# EAGLE schematic Autonomous-Car_Schematic-Extended (EAGLE 9.6.2)
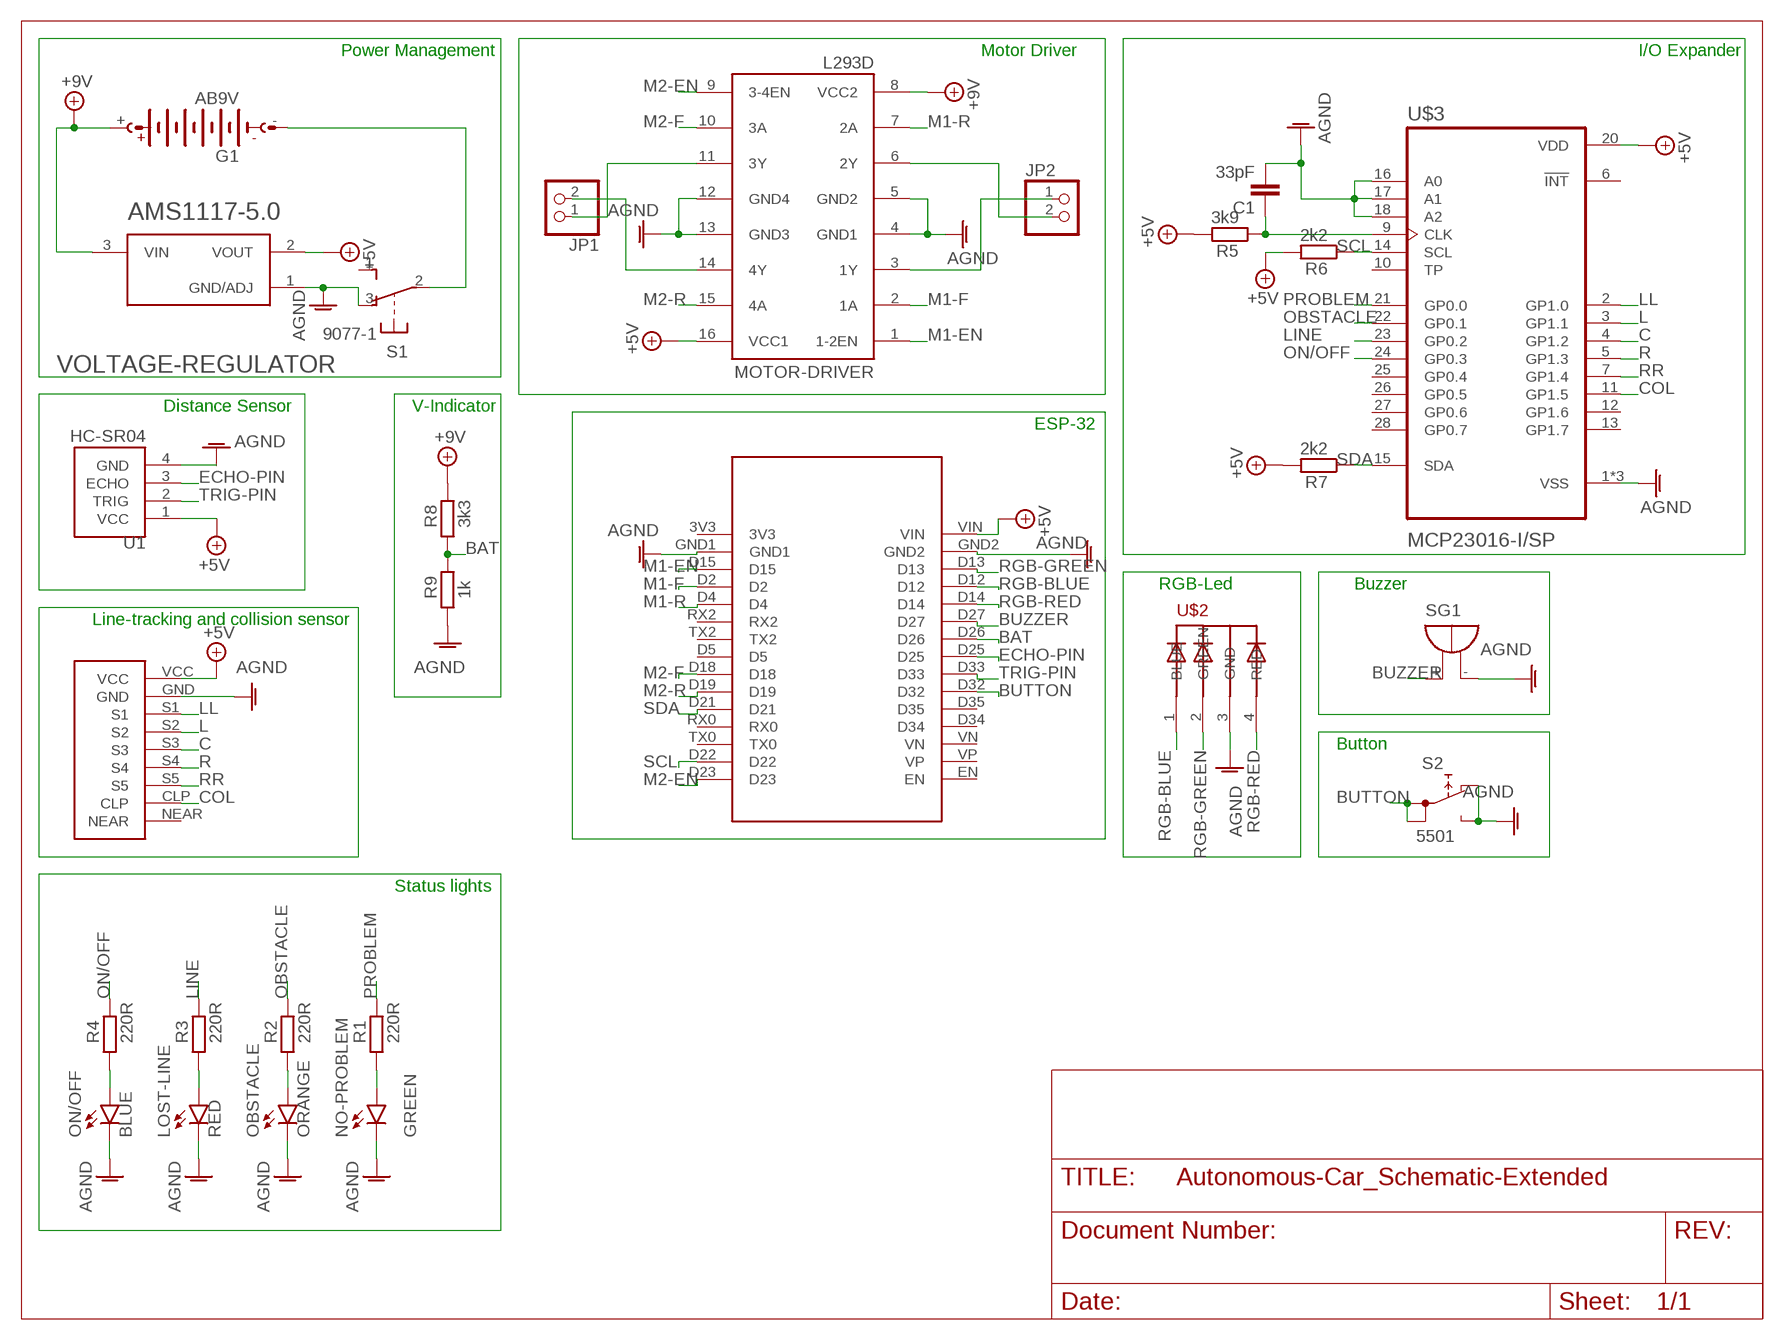
[diagram p0: schematic, sheet 1]

## Parts
C1  33pF  C-EU025-024X044  [C025-024X044]
G1  AB9V  [AB9V]
JP1  PINHD-1X2  [1X02]
JP2  PINHD-1X2  [1X02]
LINETRACKER  5XTCRT5000  [5XTCRT5000]
LOST-LINE  RED  LED5MM  [LED5MM]
MOTOR-DRIVER  L293D  [DIL16]
NO-PROBLEM  GREEN  LED5MM  [LED5MM]
OBSTACLE  ORANGE  LED5MM  [LED5MM]
ON/OFF  BLUE  LED5MM  [LED5MM]
R1  220R  R-EU_0204/5  [0204/5]
R2  220R  R-EU_0204/5  [0204/5]
R3  220R  R-EU_0204/5  [0204/5]
R4  220R  R-EU_0204/5  [0204/5]
R5  3k9  R-EU_0204/5  [0204/5]
R6  2k2  R-EU_0204/5  [0204/5]
R7  2k2  R-EU_0204/5  [0204/5]
R8  3k3  R-EU_0204/5  [0204/5]
R9  1k  R-EU_0204/5  [0204/5]
S1  9077-1  [9077-1]
S2  5501  [5501]
SG1  EB2209A  [EB2209A]
U1  HC-SR04  [XCVR_HC-SR04]
U$1  ESP32  [ESP32-FOOTPRINT]
U$2  5MMRGBLED  [LED5MMRGB]
U$3  MCP23016-I/SP  [DIP787W46P254L3467H508Q28]
VOLTAGE-REGULATOR  AMS1117-5.0  [SOT229P700X180-4N]

## Nets
+5V: LINETRACKER.VCC MOTOR-DRIVER.16(VCC1) R5.2 R6.2 R7.2 U1.1(VCC) U$1.VIN U$3.20(VDD) VOLTAGE-REGULATOR.2(VOUT)
+9V: G1.+ MOTOR-DRIVER.8(VCC2) R8.2 VOLTAGE-REGULATOR.3(VIN)
AGND: C1.2 LINETRACKER.GND LOST-LINE.K(C) MOTOR-DRIVER.4(GND1) MOTOR-DRIVER.5(GND2) MOTOR-DRIVER.12(GND4) MOTOR-DRIVER.13(GND3) NO-PROBLEM.K(C) OBSTACLE.K(C) ON/OFF.K(C) R9.1 S1.3(O) S2.NC S2.NO SG1.- U1.4(GND) U$1.GND1 U$1.GND2 U$2.3(GND) U$3.1(VSS) U$3.8(VSS) U$3.16(A0) U$3.17(A1) U$3.18(A2) U$3.19(VSS) VOLTAGE-REGULATOR.1(GND/ADJ)
BAT: R8.1 R9.2 U$1.D26
BUTTON: S2.1A S2.1B U$1.D32
BUZZER: SG1.+ U$1.D27
C: LINETRACKER.S3 U$3.4(GP1.2)
COL: LINETRACKER.CLP U$3.11(GP1.5)
ECHO-PIN: U1.3(ECHO) U$1.D25
L: LINETRACKER.S2 U$3.3(GP1.1)
LINE: R3.2 U$3.23(GP0.2)
LL: LINETRACKER.S1 U$3.2(GP1.0)
M1-EN: MOTOR-DRIVER.1(1-2EN) U$1.D15
M1-F: MOTOR-DRIVER.2(1A) U$1.D2
M1-R: MOTOR-DRIVER.7(2A) U$1.D4
M2-EN: MOTOR-DRIVER.9(3-4EN) U$1.D23
M2-F: MOTOR-DRIVER.10(3A) U$1.D18
M2-R: MOTOR-DRIVER.15(4A) U$1.D19
N$1: G1.- S1.2(P)
N$2: JP2.2 MOTOR-DRIVER.6(2Y)
N$3: JP2.1 MOTOR-DRIVER.3(1Y)
N$4: JP1.1 MOTOR-DRIVER.11(3Y)
N$5: JP1.2 MOTOR-DRIVER.14(4Y)
N$6: NO-PROBLEM.A R1.1
N$7: OBSTACLE.A R2.1
N$8: LOST-LINE.A R3.1
N$9: ON/OFF.A R4.1
N$10: C1.1 R5.1 U$3.9(CLK)
OBSTACLE: R2.2 U$3.22(GP0.1)
ON/OFF: R4.2 U$3.24(GP0.3)
PROBLEM: R1.2 U$3.21(GP0.0)
R: LINETRACKER.S4 U$3.5(GP1.3)
RGB-BLUE: U$1.D12 U$2.1(BLUE)
RGB-GREEN: U$1.D13 U$2.2(GREEN)
RGB-RED: U$1.D14 U$2.4(RED)
RR: LINETRACKER.S5 U$3.7(GP1.4)
SCL: R6.1 U$1.D22 U$3.14(SCL)
SDA: R7.1 U$1.D21 U$3.15(SDA)
TRIG-PIN: U1.2(TRIG) U$1.D33
Unconnected: LINETRACKER.NEAR S1.1(S) U$1.3V3 U$1.D5 U$1.D34 U$1.D35 U$1.EN U$1.RX0 U$1.RX2 U$1.TX0 U$1.TX2 U$1.VN U$1.VP U$3.6(!INT) U$3.10(TP) U$3.12(GP1.6) U$3.13(GP1.7) U$3.25(GP0.4) U$3.26(GP0.5) U$3.27(GP0.6) U$3.28(GP0.7)

## Notes on the sheet
- Power Management | Motor Driver | I/O Expander
- Distance Sensor | V-Indicator
- ESP-32
- RGB-Led | Buzzer
- Line-tracking and collision sensor
- Button
- Status lights

## Library data of the parts
C1 = rcl:C-EU: CAPACITOR, European symbol; SPICEPREFIX: C
G1 = battery:AB9V: 9-V BATTERY CLIP
JP1 JP2 = pinhead:PINHD-1X2: PIN HEADER
LINETRACKER = 5xTCRT5000:5XTCRT5000
LOST-LINE NO-PROBLEM OBSTACLE ON/OFF = led:LED: LED OSRAM: - CHIPLED LG R971, LG N971, LY N971, LG Q971, LY Q971, LO R971, LY R971 LH N974, LH R974 LS Q976, LO Q976, LY Q976 LO Q996 - Hyper CHIPLED LW Q18S LB Q993, LB Q99A, LB R99A - SideLED LS A670, LO A670, LY A670, LG A670, LP A670 LB A673, LV A673, LT A673, LW A673 LH A674 LY A675 LS A676, LA A676, LO A676, LY A676, LW A676 LS A679, LY A679, LG A679 - Hyper Micro SIDELED® LS Y876, LA Y876, LO Y876, LY Y876 LT Y87S - SmartLED LW L88C, LW L88S LB L89C, LB L89S, LG L890 LS L89K, LO L89K, LY L89K LS L896, LA L896, LO L896, LY L896 - TOPLED LS T670, LO T670, LY T670, LG T670, LP T670 LSG T670, LSP T670, LSY T670, LOP T670, LYG T670 LG T671, LOG T671, LSG T671 LB T673, LV T673, LT T673, LW T673 LH T674 LS T676, LA T676, LO T676, LY T676, LB T676, LH T676, LSB T676, LW T676 LB T67C, LV T67C, LT T67C, LS T67K, LO T67K, LY T67K, LW E67C LS E67B, LA E67B, LO E67B, LY E67B, LB E67C, LV E67C, LT E67C LW T67C LS T679, LY T679, LG T679 LS T770, LO T770, LY T770, LG T770, LP T770 LB T773, LV T773, LT T773, LW T773 LH T774 LS E675, LA E675, LY E675, LS T675 LS T776, LA T776, LO T776, LY T776, LB T776 LHGB T686 LT T68C, LB T68C - Hyper Mini TOPLED® LB M676 - Mini TOPLED Santana® LG M470 LS M47K, LO M47K, LY M47K Source: http://www.osram.convergy.de LUXEON: - LUMILED® LXK2-PW12-R00, LXK2-PW12-S00, LXK2-PW14-U00, LXK2-PW14-V00 LXK2-PM12-R00, LXK2-PM12-S00, LXK2-PM14-U00 LXK2-PE12-Q00, LXK2-PE12-R00, LXK2-PE12-S00, LXK2-PE14-T00, LXK2-PE14-U00 LXK2-PB12-K00, LXK2-PB12-L00, LXK2-PB12-M00, LXK2-PB14-N00, LXK2-PB14-P00, LXK2-PB14-Q00 LXK2-PR12-L00, LXK2-PR12-M00, LXK2-PR14-Q00, LXK2-PR14-R00 LXK2-PD12-Q00, LXK2-PD12-R00, LXK2-PD12-S00 LXK2-PH12-R00, LXK2-PH12-S00 LXK2-PL12-P00, LXK2-PL12-Q00, LXK2-PL12-R00 Source: www.luxeon.com KINGBRIGHT: KA-3528ASYC Source: www.kingbright.com
MOTOR-DRIVER = st-microelectronics:L293D: PUSH-PULL 4 CHANNEL DRIVER; MPN: L293D; OC_FARNELL: 9589619; OC_NEWARK: 56P8249
R1-R9 = rcl:R-EU_: RESISTOR, European symbol; SPICEPREFIX: R
S1 = switch-misc:9077-1: MARQUARDT SWITCH 9077.0100 Distributor: Buerklin <https://www.buerklin.com/default.asp?event=ShowArtikel%2812G2820%29&l=d&jump=ArtNr_12G2820>
S2 = switch:55?: PUSHBUTTON SERIES 5500 SWITCHES Source: www.e-switch.com .. 5500.pdf
SG1 = buzzer:EB2209A: BUZZER Source: Buerklin; OC_FARNELL: unknown; OC_NEWARK: unknown
U1 = HC-SR04:HC-SR04: Ultrasonic Sensor Module Check availability <https://pricing.snapeda.com/parts/HC-SR04/SparkFun%20Electronics/view-part?ref=eda>; AVAILABILITY: Not in stock; DESCRIPTION: HC-SR04 Ultrasonic Sensor Qwiic Platform Evaluation Expansion Board; MF: SparkFun Electronics; MP: HC-SR04; PACKAGE: None; PRICE: None
U$1 = ESP32_Mini-D1:ESP32: Joy-IT ESP32 Module
U$2 = adafruit:5MMRGBLED
U$3 = MCP23016-I_SP:MCP23016-I/SP: Check availability <https://pricing.snapeda.com/parts/MCP23016-I/SP/Microchip%20Technology/view-part?ref=eda>; AVAILABILITY: In Stock; DESCRIPTION: I/O Expander 16 I²C 400 kHz 28-SPDIP; MF: Microchip Technology; MP: MCP23016-I/SP; PACKAGE: SPDIP-28 Microchip; PRICE: None; PURCHASE-URL: https://pricing.snapeda.com/search/part/MCP23016-I/SP/?ref=eda
VOLTAGE-REGULATOR = AMS1117-5.0:AMS1117-5.0: Check availability <https://pricing.snapeda.com/parts/AMS1117-5.0/Advanced%20Monolithic%20Systems/view-part?ref=eda>; AVAILABILITY: Not in stock; DESCRIPTION: Sot223/Pkg 1-Amp 5-Volt Low Drop Out Voltage Regulatator; MF: Advanced Monolithic Systems; MP: AMS1117-5.0; PACKAGE: SOT-223 Seeed Technology; PRICE: None